# EAGLE schematic BreakoutIcosaStellaOval (EAGLE 6.5.0)
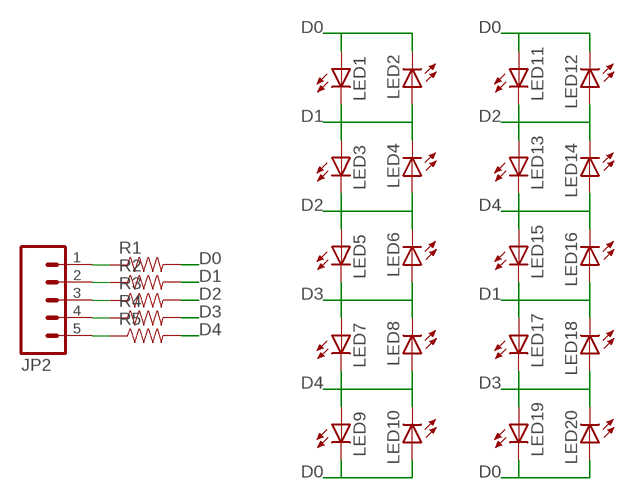
[diagram p0: schematic, sheet 1]

## Parts
JP2  M05PTH  [1X05]
LED1  LEDOVAL  [LED-OVAL]
LED2  LEDOVAL  [LED-OVAL]
LED3  LEDOVAL  [LED-OVAL]
LED4  LEDOVAL  [LED-OVAL]
LED5  LEDOVAL  [LED-OVAL]
LED6  LEDOVAL  [LED-OVAL]
LED7  LEDOVAL  [LED-OVAL]
LED8  LEDOVAL  [LED-OVAL]
LED9  LEDOVAL  [LED-OVAL]
LED10  LEDOVAL  [LED-OVAL]
LED11  LEDOVAL  [LED-OVAL]
LED12  LEDOVAL  [LED-OVAL]
LED13  LEDOVAL  [LED-OVAL]
LED14  LEDOVAL  [LED-OVAL]
LED15  LEDOVAL  [LED-OVAL]
LED16  LEDOVAL  [LED-OVAL]
LED17  LEDOVAL  [LED-OVAL]
LED18  LEDOVAL  [LED-OVAL]
LED19  LEDOVAL  [LED-OVAL]
LED20  LEDOVAL  [LED-OVAL]
R1  RESISTORAXIAL-0.3  [AXIAL-0.3]
R2  RESISTORAXIAL-0.3  [AXIAL-0.3]
R3  RESISTORAXIAL-0.3  [AXIAL-0.3]
R4  RESISTORAXIAL-0.3  [AXIAL-0.3]
R5  RESISTORAXIAL-0.3  [AXIAL-0.3]

## Nets
D0: LED1.ANODE(A) LED2.CATHODE(C) LED9.CATHODE(C) LED10.ANODE(A) LED11.ANODE(A) LED12.CATHODE(C) LED19.CATHODE(C) LED20.ANODE(A) R1.P$2
D1: LED1.CATHODE(C) LED2.ANODE(A) LED3.ANODE(A) LED4.CATHODE(C) LED15.CATHODE(C) LED16.ANODE(A) LED17.ANODE(A) LED18.CATHODE(C) R2.P$2
D2: LED3.CATHODE(C) LED4.ANODE(A) LED5.ANODE(A) LED6.CATHODE(C) LED11.CATHODE(C) LED12.ANODE(A) LED13.ANODE(A) LED14.CATHODE(C) R3.P$2
D3: LED5.CATHODE(C) LED6.ANODE(A) LED7.ANODE(A) LED8.CATHODE(C) LED17.CATHODE(C) LED18.ANODE(A) LED19.ANODE(A) LED20.CATHODE(C) R4.P$2
D4: LED7.CATHODE(C) LED8.ANODE(A) LED9.ANODE(A) LED10.CATHODE(C) LED13.CATHODE(C) LED14.ANODE(A) LED15.ANODE(A) LED16.CATHODE(C) R5.P$2
N$1: JP2.1 R1.P$1
N$2: JP2.2 R2.P$1
N$3: JP2.3 R3.P$1
N$4: JP2.4 R4.P$1
N$5: JP2.5 R5.P$1

## Library data of the parts
JP2 = SparkFun-Connectors:M05: Header 5 Standard 5-pin 0.1" header. Use with straight break away headers (SKU : PRT-00116), right angle break away headers (PRT-00553), swiss pins (PRT-00743), machine pins (PRT-00117), and female headers (PRT-00115). Molex polarized connector foot print use with SKU : PRT-08230 with associated crimp pins and housings.
LED1-LED20 = barbary_enterprises:LED: LEDs Standard schematic elements and footprints for 5mm, 3mm, 1206, and 0603 sized LEDs. 5mm - Spark Fun Electronics SKU : COM-00529 (and others)
R1-R5 = SparkFun-Resistors:RESISTOR: Resistor Basic schematic elements and footprints for 0603, 1206, and PTH resistors.